# Altium schematic sheet EVO Schematic.SchDoc: Cable Node (part 2 of 3)
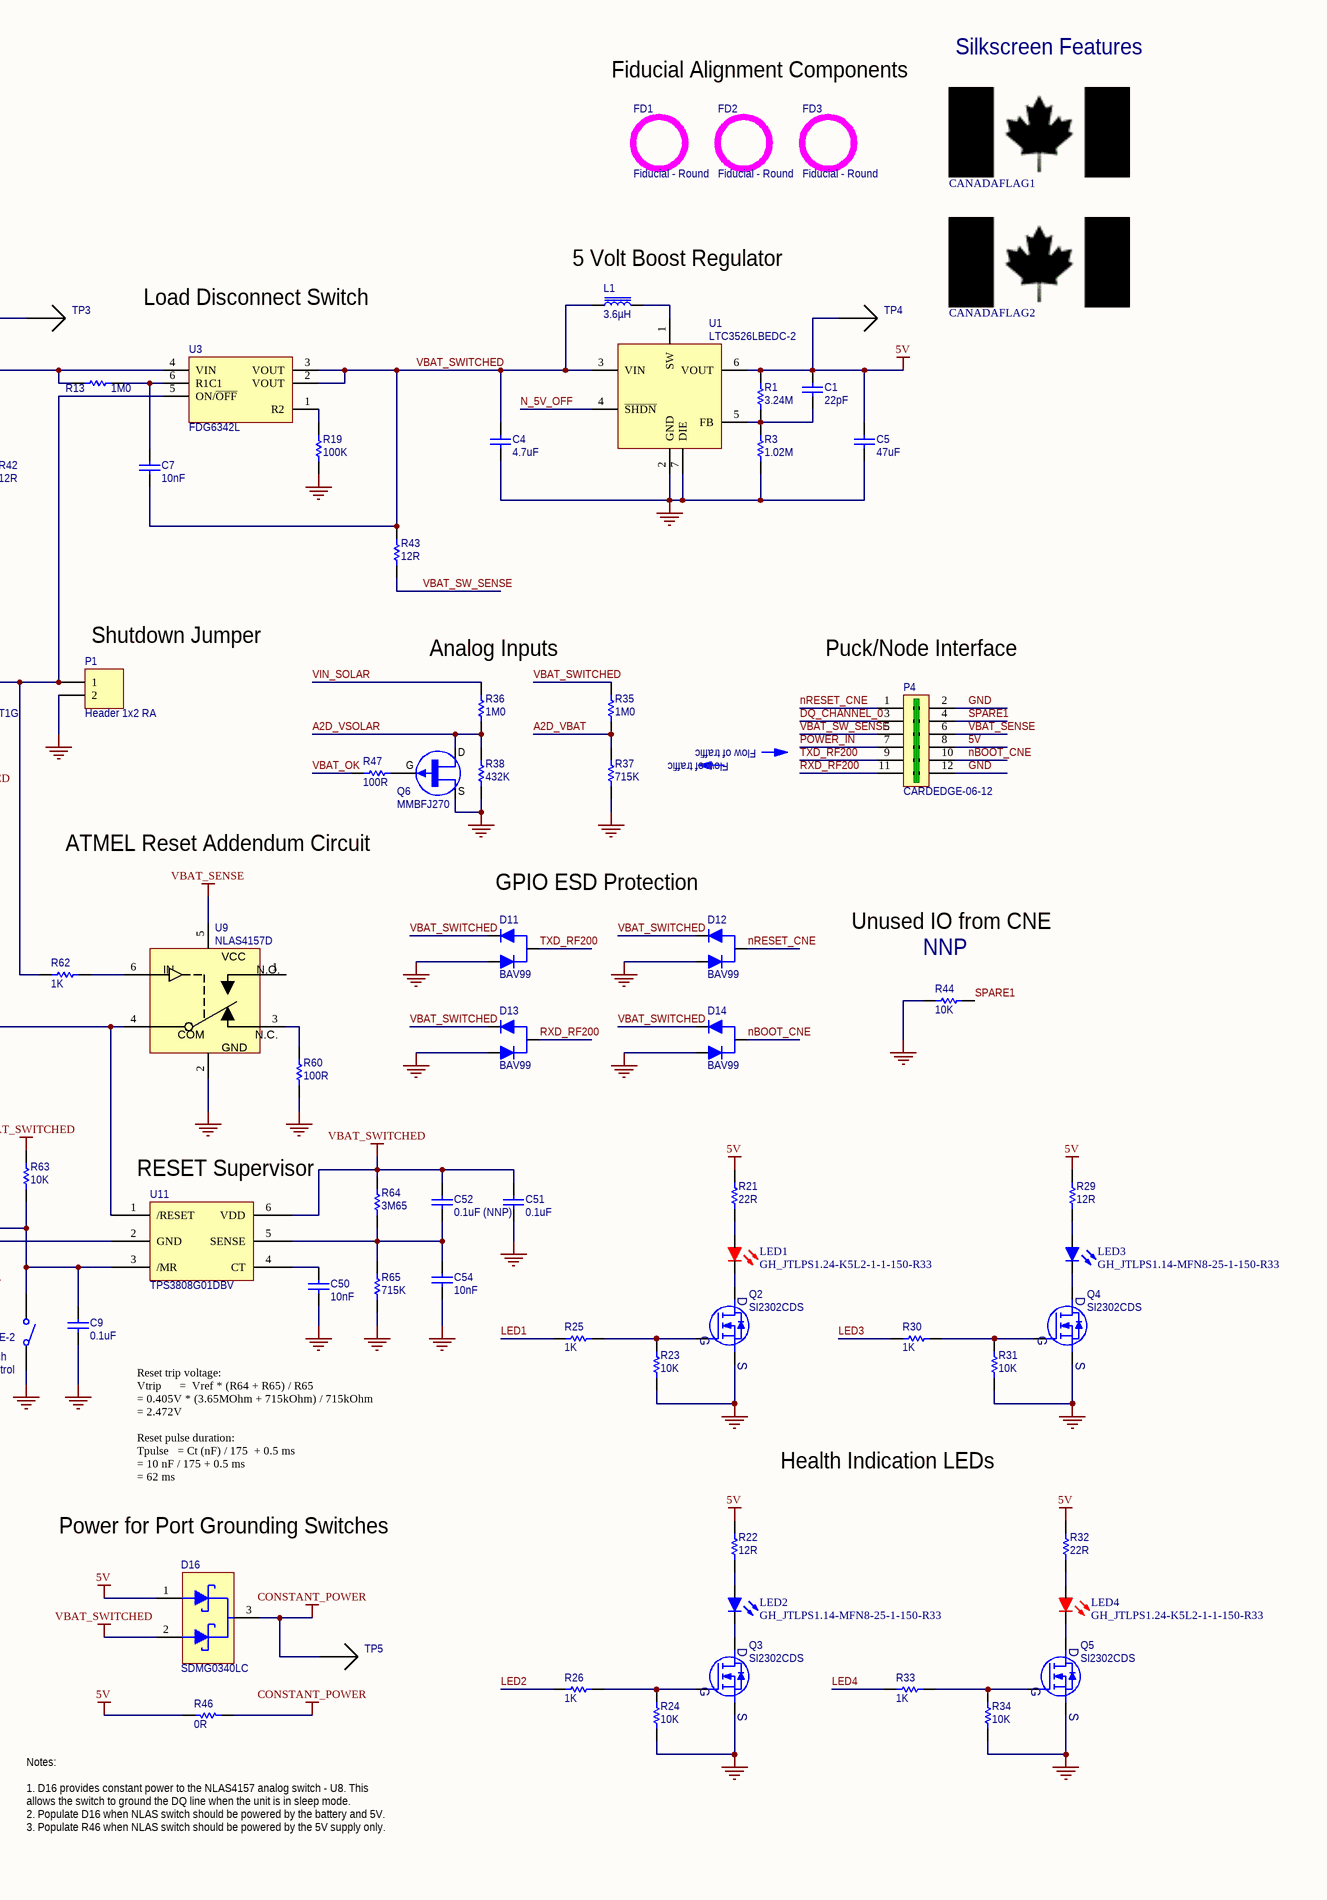
[diagram p2: EVO Schematic.SchDoc, right]
## Library data of the parts
BATT1 = BATT_18650_1: 26650 LiFePO4 3.2V 3300mAh; Manufacturer: TACBattery; Manufacturer Part Number: 26650 3.2V 1500mAh with wire; OPI_VID: 101392
C1 = CC0805JRNPO9BN220: CAP CER 22PF 50V 5% NPO 0805; Manufacturer: Yageo; Temperature Coefficient: C0G, NP0; OPI_VID: 100045; Supplier 1: Digi-Key; Manufacturer Part Number: CC0805JRNPO9BN220; RoHS: RoHS Compliant; Category: Capacitors; Stock 1: 184000; Pricing 1: 4000=0.0128, 8000=0.01169, 12000=0.01113, 28000=0.01057, 100000=0.00765 (CAD); Capacitance: 22pF; Voltage - Rated: 50V; Tolerance: ±5%; Mounting Type: Surface Mount, MLCC; Operating Temperature: -55°C ~ 125°C; Applications: General Purpose; Ratings: -; Package / Case: 0805 (2012 Metric); Size / Dimension: 0.079" L x 0.049" W (2.00mm x 1.25mm); Height - Seated (Max): -; Thickness (Max): 0.024" (0.60mm); Lead Spacing: -; Features: -; Packaging: Tape & Reel (TR); Lead Style: -; ComponentLink1URL: http://www.yageo.com/documents/recent/UPY-GP_NP0_16V-to-50V_8.pdf; ComponentLink1Description: http://www.yageo.com/documents/recent/UPY-GP_NP0_16V-to-50V_8.pdf; Supplier Part Number 1: 311-1103-2-ND
C2-C4 = JMK212BJ475KG-T: CAP CER 4.7UF 6.3V 10% X5R 0805; Manufacturer: Taiyo Yuden; Capacitance: 4.7µF; OPI_VID: 101023; Supplier 1: Digi-Key; Manufacturer Part Number: JMK212BJ475KG-T; RoHS: RoHS Compliant; Category: Capacitors; Stock 1: 114000; Pricing 1: 3000=0.02419, 6000=0.02213, 9000=0.02059, 15000=0.01956, 30000=0.01853 (CAD); Voltage - Rated: 6.3V; Tolerance: ±10%; Temperature Coefficient: X5R; Mounting Type: Surface Mount, MLCC; Operating Temperature: -55°C ~ 85°C; Applications: General Purpose; Ratings: -; Package / Case: 0805 (2012 Metric); Size / Dimension: 0.079" L x 0.049" W (2.00mm x 1.25mm); Height - Seated (Max): -; Thickness (Max): 0.053" (1.35mm); Lead Spacing: -; Features: -; Packaging: Tape & Reel (TR); Lead Style: -; ComponentLink1URL: http://www.yuden.co.jp/productdata/catalog/en/mlcc01_e.pdf; ComponentLink1Description: http://www.yuden.co.jp/productdata/catalog/en/mlcc01_e.pdf; Supplier Part Number 1: 587-1302-2-ND
C5 C8 = LMK316BJ476ML-T: CAP CER 47UF 10V 20% X5R 1206; Manufacturer: Taiyo Yuden; Capacitance: 47µF; OPI_VID: 101319; Supplier 1: Digi-Key; Supplier Part Number 1: 587-1780-2-ND; Manufacturer Part Number: LMK316BJ476ML-T; RoHS: RoHS Compliant; Category: Capacitors; Stock 1: 38000; Pricing 1: 2000=0.20677, 4000=0.19298, 10000=0.18609, 14000=0.18333, 50000=0.17575 (CAD); Voltage - Rated: 10V; Tolerance: ±20%; Temperature Coefficient: X5R; Mounting Type: Surface Mount, MLCC; Operating Temperature: -55°C ~ 85°C; Applications: General Purpose; Ratings: -; Package / Case: 1206 (3216 Metric); Size / Dimension: 0.126" L x 0.063" W (3.20mm x 1.60mm); Height - Seated (Max): -; Thickness (Max): 0.071" (1.80mm); Lead Spacing: -; Features: -; Packaging: Tape & Reel (TR); Lead Style: -; ComponentLink1URL: http://www.yuden.co.jp/productdata/catalog/en/mlcc01_e.pdf; ComponentLink1Description: http://www.yuden.co.jp/productdata/catalog/en/mlcc01_e.pdf
C6 = C2012X7R2A103K: CAP CER 10000PF 100V X7R 0805; Manufacturer: TDK Corporation; Tolerance: ±10%; OPI_VID: 101320; Supplier 1: Digi-Key; Manufacturer Part Number: C2012X7R2A103K; RoHS: RoHS Compliant; Category: Capacitors; Stock 1: 44000; Pricing 1: 4000=0.01844, 8000=0.01716, 12000=0.0163, 28000=0.01544, 100000=0.01169 (CAD); Capacitance: 10000pF; Voltage - Rated: 100V; Temperature Coefficient: X7R; Mounting Type: Surface Mount, MLCC; Operating Temperature: -55°C ~ 125°C; Applications: General Purpose; Ratings: -; Package / Case: 0805 (2012 Metric); Size / Dimension: 0.079" L x 0.049" W (2.00mm x 1.25mm); Height - Seated (Max): -; Thickness (Max): 0.037" (0.95mm); Lead Spacing: -; Features: -; Packaging: Tape & Reel (TR); Lead Style: -; ComponentLink1URL: http://www.tdk.com/pdf/mid_volt_B11.pdf; ComponentLink1Description: http://www.tdk.com/pdf/mid_volt_B11.pdf; Supplier Part Number 1: 445-1343-2-ND
C7 C50 C54 = C1608X7R1H103K: CAP CER 10000PF 50V 10% X7R 0603; Manufacturer: TDK Corporation; OPI_VID: 101017; Supplier 1: Digi-Key; Supplier Part Number 1: 445-1311-2-ND; Manufacturer Part Number: C1608X7R1H103K; RoHS: RoHS Compliant; Category: Capacitors; Stock 1: 292000; Pricing 1: 4000=0.00488, 8000=0.00445, 12000=0.00424, 28000=0.00403, 100000=0.00292 (CAD); Capacitance: 10000pF; Voltage - Rated: 50V; Tolerance: ±10%; Temperature Coefficient: X7R; Mounting Type: Surface Mount, MLCC; Operating Temperature: -55°C ~ 125°C; Applications: General Purpose; Ratings: -; Package / Case: 0603 (1608 Metric); Size / Dimension: 0.063" L x 0.031" W (1.60mm x 0.80mm); Height - Seated (Max): -; Thickness (Max): 0.037" (0.95mm); Lead Spacing: -; Features: -; Packaging: Tape & Reel (TR); Lead Style: -; ComponentLink1URL: http://www.tdk.com/pdf/general_B11.pdf; ComponentLink1Description: http://www.tdk.com/pdf/general_B11.pdf
C9 = 0603YC104KAT2A: CAP CERM .1UF 10% 16V X7R 0603; Manufacturer: AVX Corporation; Capacitance: 0.1µF; OPI_VID: 100039; Category 1: Capacitors; Supplier 1: Digi-Key; Manufacturer Part Number: 0603YC104KAT2A; Stock 1: 5240000; Pricing 1: 4000=0.003, 12000=0.002, 24000=0.002 (USD); Voltage - Rated: 16V; Tolerance: ±10%; Temperature Coefficient: X7R; Mounting Type: Surface Mount, MLCC; Operating Temperature: -55°C ~ 125°C; Applications: General Purpose; Ratings: -; Package / Case: 0603 (1608 Metric); Size / Dimension: 0.063" L x 0.031" W (1.60mm x 0.80mm); Lead Spacing: -; Features: -; Packaging: Tape & Reel (TR); Lead Style: -; ComponentLink1URL: http://www.avx.com/docs/Catalogs/cx7r.pdf; ComponentLink1Description: http://www.avx.com/docs/Catalogs/cx7r.pdf; Supplier Part Number 1: 478-1239-2-ND; RoHS 1: RoHS Compliant; Description 1: CAP CERM .1UF 10% 16V X7R 0603; Thickness: 0.90mm Max
C10 C11 C20 C51-C53 = 0603YC104KAT2A: CAP CERM .1UF 10% 16V X7R 0603; Manufacturer: AVX Corporation; Category 1: Capacitors; Capacitance: 0.1µF; OPI_VID: 100039; Supplier 1: Digi-Key; Supplier Part Number 1: 478-1239-2-ND; RoHS 1: RoHS Compliant; Description 1: CAP CERM .1UF 10% 16V X7R 0603; Stock 1: 5240000; Pricing 1: 4000=0.003, 12000=0.002, 24000=0.002 (USD); Voltage - Rated: 16V; Tolerance: ±10%; Temperature Coefficient: X7R; Mounting Type: Surface Mount, MLCC; Operating Temperature: -55°C ~ 125°C; Features: -; Applications: General Purpose; Ratings: -; Package / Case: 0603 (1608 Metric); Size / Dimension: 0.063" L x 0.031" W (1.60mm x 0.80mm); Thickness: 0.90mm Max; Lead Spacing: -; Packaging: Tape & Reel (TR); Lead Style: -; ComponentLink1URL: http://www.avx.com/docs/Catalogs/cx7r.pdf; ComponentLink1Description: http://www.avx.com/docs/Catalogs/cx7r.pdf; Manufacturer Part Number: 0603YC104KAT2A
CANADAFLAG1 CANADAFLAG2 = CanadaFlag
D1 D4 = DFLS1200-7: DIODE SCHOTTKY 1A 200V PWRDI 123; Manufacturer: Diodes Inc; Voltage - Forward (Vf) (Max) @ If: 850mV @ 1A; Speed: Fast Recovery =< 500ns, > 200mA (Io); Current - Reverse Leakage @ Vr: 2µA @ 200V; Capacitance @ Vr, F: 23pF @ 5V, 1MHz; OPI_VID: 101018; Supplier 1: Digi-Key; Supplier Part Number 1: DFLS1200DITR-ND; Manufacturer Part Number: DFLS1200-7; RoHS: RoHS Compliant; Category: Discrete Semiconductor Products; Stock 1: 21000; Pricing 1: 3000=0.22411, 6000=0.21017, 12000=0.19516, 27000=0.18444, 51000=0.18122 (CAD); Diode Type: Schottky; Voltage - DC Reverse (Vr) (Max): 200V; Current - Average Rectified (Io): 1A; Reverse Recovery Time (trr): -; Mounting Type: Surface Mount; Package / Case: 2-SMD, Flat Lead; Supplier Device Package: PowerDI™ 123; Packaging: Tape & Reel (TR); ComponentLink1URL: http://www.diodes.com/datasheets/ds30628.pdf; ComponentLink1Description: http://www.diodes.com/datasheets/ds30628.pdf
D2 D5 D10 = PGB1010603NR: SUPPRESSOR ESD 24VDC 0603 SMD; Manufacturer: Littelfuse Inc; Category 1: Circuit Protection; Voltage - Reverse Standoff (Typ): 24V; Polarization: Bidirectional; OPI_VID: 101020; Supplier 1: Digi-Key; Supplier Part Number 1: F3591TR-ND; RoHS 1: RoHS Compliant; Description 1: SUPPRESSOR ESD 24VDC 0603 SMD; Stock 1: 10000; Pricing 1: 5000=0.189, 10000=0.176, 25000=0.166 (USD); Voltage - Breakdown: -; Power (Watts): -; Mounting Type: Surface Mount; Package / Case: 0603 (1608 Metric); Supplier Device Package: 0603 (1608 Metric); Packaging: Tape & Reel (TR); ComponentLink1URL: http://www.littelfuse.com/data/en/Data_Sheets/Littelfuse_PulseGuard-ESD_PGB1.pdf; ComponentLink1Description: http://www.littelfuse.com/data/en/Data_Sheets/Littelfuse_PulseGuard-ESD_PGB1.pdf; Manufacturer Part Number: PGB1010603NR
D3 D11-D14 = BAV99-7-F: DIODE SW DUAL 75V 350MW SOT23-3; Manufacturer: Diodes Inc; Voltage - Forward (Vf) (Max) @ If: 1.25V @ 150mA; Current - Reverse Leakage @ Vr: 2.5µA @ 75V; Current - Average Rectified (Io) (per Diode): 300mA (DC); Reverse Recovery Time (trr): 4ns; Diode Type: Standard; Speed: Fast Recovery =< 500ns, > 200mA (Io); Diode Configuration: 1 Pair Series Connection; OPI_VID: 101321; Supplier 1: Digi-Key; Manufacturer Part Number: BAV99-7-F; RoHS: RoHS Compliant; Category: Discrete Semiconductor Products; Stock 1: 297000; Pricing 1: 3000=0.02704, 6000=0.02439, 15000=0.02121, 30000=0.01909, 75000=0.01697, 150000=0.0141 (CAD); Voltage - DC Reverse (Vr) (Max): 75V; Mounting Type: Surface Mount; Package / Case: TO-236-3, SC-59, SOT-23-3; Supplier Device Package: SOT-23-3; Packaging: Tape & Reel (TR); ComponentLink1URL: http://www.diodes.com/datasheets/ds12007.pdf; ComponentLink1Description: http://www.diodes.com/datasheets/ds12007.pdf; Supplier Part Number 1: BAV99-FDITR-ND
D6 D8 D9 = ESD5B5.0ST1G: TVS BIDIRECT 50W SOD523; Manufacturer: ON Semiconductor; Voltage - Reverse Standoff (Typ): 5V; Voltage - Breakdown: 5.8V; Polarization: Bidirectional; OPI_VID: 101019; Supplier 1: Digi-Key; Supplier Part Number 1: ESD5B5.0ST1GOSTR-ND; Manufacturer Part Number: ESD5B5.0ST1G; RoHS: RoHS Compliant; Category: Circuit Protection; Stock 1: 240000; Pricing 1: 3000=0.06935, 6000=0.06253, 12000=0.05571, 24000=0.0523, 48000=0.04661, 96000=0.04548 (CAD); Power (Watts): 50W; Mounting Type: Surface Mount; Package / Case: SC-79, SOD-523; Supplier Device Package: SOD-523; Packaging: Tape & Reel (TR); ComponentLink1URL: http://www.onsemi.com/pub_link/Collateral/ESD5B5.0ST1G.PDF; ComponentLink1Description: http://www.onsemi.com/pub_link/Collateral/ESD5B5.0ST1G.PDF
D15 = DDZ5V6ASF-7: DIODE ZENER 5.42V 500MW SOD323F; Manufacturer: Diodes Inc; Voltage - Forward (Vf) (Max) @ If: 900mV @ 10mA; Current - Reverse Leakage @ Vr: 7.5µA @ 2V; Tolerance: ±2%; Impedance (Max) (Zzt): 80 Ohm; OPI_VID: 101383; Supplier 1: Digi-Key; Supplier Part Number 1: DDZ5V6ASF-7DITR-ND; Manufacturer Part Number: DDZ5V6ASF-7; RoHS: RoHS Compliant; Category: Discrete Semiconductor Products; Stock 1: 6000; Pricing 1: 3000=0.02937, 6000=0.02649, 15000=0.02304, 30000=0.02073, 75000=0.01843, 150000=0.01532 (CAD); Voltage - Zener (Nom) (Vz): 5.42V; Power - Max: 500mW; Mounting Type: Surface Mount; Package / Case: SC-90, SOD-323F; Supplier Device Package: SOD-323F; Packaging: Tape & Reel (TR); Operating Temperature: -65°C ~ 150°C; ComponentLink1URL: http://www.diodes.com/datasheets/ds31987.pdf; ComponentLink1Description: http://www.diodes.com/datasheets/ds31987.pdf
D16 = SDMG0340LC-7-F: DIODE SCHOTTKY 40V 30MA SOT323; Manufacturer: Diodes Inc; Voltage - Forward (Vf) (Max) @ If: 370mV @ 1mA; Current - Reverse Leakage @ Vr: 1µA @ 10V; Current - Average Rectified (Io) (per Diode): 30mA (DC); Speed: Small Signal =< 200mA (Io), Any Speed; Diode Configuration: 1 Pair Common Cathode; OPI_VID: 101482; Supplier 1: Digi-Key; Supplier Part Number 1: SDMG0340LC-FDITR-ND; Manufacturer Part Number: SDMG0340LC-7-F; RoHS: RoHS Compliant; Category: Discrete Semiconductor Products; Stock 1: 18000; Pricing 1: 3000=0.08059, 6000=0.07254, 15000=0.06447, 30000=0.06045, 75000=0.05359, 150000=0.05037 (CAD); Packaging: Tape & Reel (TR); Voltage - DC Reverse (Vr) (Max): 40V; Reverse Recovery Time (trr): -; Diode Type: Schottky; Mounting Type: Surface Mount; Package / Case: SC-70, SOT-323; Supplier Device Package: SOT-323; ComponentLink1URL: http://www.diodes.com/datasheets/ds30248.pdf; ComponentLink1Description: http://www.diodes.com/datasheets/ds30248.pdf
F1 = MINISMDC260F-2: POLYSWITCH 2.6A RESET FUSE SMD; Manufacturer: TE Connectivity; Current - Trip (It): 5A; Current - Max: 100A; Voltage - Max: 6V; R Min/Max: 0.015 ~ 0.043 Ohm; Time to Trip: 7s; OPI_VID: 101385; Supplier 1: Digi-Key; Manufacturer Part Number: MINISMDC260F-2; RoHS: RoHS Compliant; Category: Circuit Protection; Stock 1: 6000; Pricing 1: 2000=0.2349, 6000=0.21802, 10000=0.18285, 26000=0.17582, 50000=0.16879 (CAD); Current - Hold (Ih) (Max): 2.6A; Package / Case: 1812 (4532 Metric), Concave; Packaging: Tape & Reel (TR); ComponentLink1URL: http://www.te.com/commerce/DocumentDelivery/DDEController?Action=showdoc&DocId=Catalog+Section%7FSURFACE-MOUNT%7FA1%7Fpdf%7FEnglish%7FENG_CS_SURFACE-MOUNT_A1.pdf; ComponentLink1Description: http://www.te.com/commerce/DocumentDelivery/DDEController?Action=showdoc&DocId=Catalog+Section%7FSURFACE-MOUNT%7FA1%7Fpdf%7FEnglish%7FENG_CS_SURFACE-MOUNT_A1.pdf; Supplier Part Number 1: MINISMDC260FTR-ND
F2 F3 = MINISMDC050F-2: POLYSWITCH .50A RESET FUSE SMD; Manufacturer: TE Connectivity; Voltage - Max: 24V; Current - Max: 100A; Current - Hold (Ih) (Max): 500mA; Current - Trip (It): 1A; R Min/Max: 0.150 ~ 1.000 Ohm; Time to Trip: 0.15s; OPI_VID: 101164; Supplier 1: Digi-Key; Supplier Part Number 1: MINISMDC050FTR-ND; Manufacturer Part Number: MINISMDC050F-2; RoHS: RoHS Compliant; Category: Circuit Protection; Stock 1: 166000; Pricing 1: 2000=0.19128, 6000=0.17753, 10000=0.1489, 26000=0.14317, 50000=0.13745 (CAD); Package / Case: 1812 (4532 Metric), Concave; Packaging: Tape & Reel (TR); ComponentLink1URL: http://documents.tycoelectronics.com/commerce/DocumentDelivery/DDEController?Action=showdoc&DocId=Specification+Or+Standard%7FSCD25063%7FH%7Fpdf%7FEnglish%7FENG_SS_SCD25063_H.pdf; ComponentLink1Description: http://documents.tycoelectronics.com/commerce/DocumentDelivery/DDEController?Action=showdoc&DocId=Specification+Or+Standard%7FSCD25063%7FH%7Fpdf%7FEnglish%7FENG_SS_SCD25063_H.pdf
FD1-FD3 = Fiducial: Fiducial Round
J1 = 436500216: CONN HEADER 2POS 3MM VERT GOLD; Manufacturer: Molex Inc; Connector Type: Header, Shrouded; Number of Positions: 2; Number of Positions Loaded: All; Pitch: 0.118" (3.00mm); OPI_VID: 101531; Supplier 1: Digi-Key; Manufacturer Part Number: 436500216; RoHS: RoHS Compliant; Category: Connectors, Interconnects; Stock 1: 29740; Pricing 1: 1=0.82, 10=0.766, 50=0.612, 100=0.5866, 250=0.53552, 500=0.51002, 1000=0.42077, 2500=0.38251, 5000=0.36976 (CAD); Contact Type: Male Pin; Number of Rows: 1; Row Spacing: -; Contact Mating Length: -; Mounting Type: Through Hole; Termination: Press-Fit; Fastening Type: Locking Ramp; Features: Board Guide; Contact Finish: Tin; Contact Finish Thickness: 100µin (2.54µm); Color: Black; Packaging: Tray; ComponentLink1URL: http://www.molex.com/pdm_docs/sd/436500215_sd.pdf; ComponentLink1Description: http://www.molex.com/pdm_docs/sd/436500215_sd.pdf
L1 = 744031003: INDUCTOR POWER 3.6UH 1.38A SMD; Manufacturer: Wurth Electronics Inc; Current - Saturation: 1.1A; Type: Ferrite Core; Tolerance: ±30%; Shielding: Shielded; DC Resistance (DCR): 85 mOhm Max; Frequency - Self Resonant: 80MHz; Material - Core: Ferrite; Frequency - Test: 100kHz; OPI_VID: 101322; Supplier 1: Digi-Key; Manufacturer Part Number: 744031003; RoHS: RoHS Compliant; Category: Inductors, Coils, Chokes; Stock 1: 0; Pricing 1: 1000=0.76734 (CAD); Inductance: 3.6µH; Current: 1.38A; Current - Temperature Rise: -; Q @ Freq: -; Package / Case: 1515 (3838 Metric); Mounting Type: Surface Mount; Packaging: Tape & Reel (TR); Operating Temperature: -40°C ~ 125°C; ComponentLink1URL: http://katalog.we-online.de/kataloge/eisos/media/pdf/744031003.pdf; ComponentLink1Description: http://katalog.we-online.de/kataloge/eisos/media/pdf/744031003.pdf; Supplier Part Number 1: 732-1007-2-ND
L2 = SRR0604-220ML: INDUCTOR PWR 22UH 20% SHIELD SMD; Manufacturer: Bourns Inc.; Current: 900mA; Current - Saturation: 1.2A; Type: Ferrite Core; Shielding: Shielded; DC Resistance (DCR): 190 mOhm; Q @ Freq: 16 @ 2.52MHz; Frequency - Self Resonant: 25MHz; Material - Core: Ferrite; Frequency - Test: 1kHz; OPI_VID: 101323; Supplier 1: Digi-Key; Manufacturer Part Number: SRR0604-220ML; RoHS: RoHS Compliant; Category: Inductors, Coils, Chokes; Stock 1: 0; Pricing 1: 1000=0.37682, 5000=0.36426, 10000=0.3517, 25000=0.33914 (CAD); Inductance: 22µH; Current - Temperature Rise: -; Tolerance: ±20%; Package / Case: 0.256" L x 0.256" W x 0.189" H (6.50mm x 6.50mm x 4.80mm); Mounting Type: Surface Mount; Packaging: Tape & Reel (TR); Operating Temperature: -40°C ~ 125°C; ComponentLink1URL: http://www.bourns.com/data/global/pdfs/SRR0604.pdf; ComponentLink1Description: http://www.bourns.com/data/global/pdfs/SRR0604.pdf; Supplier Part Number 1: SRR0604-220MLTR-ND
LED1 LED4 = GH_JTLPS1.24-K5L2-1-1-150-R33: LED; Manufacturer_Name: OSRAM; Manufacturer_Part_Number: GH JTLPS1.24-K5L2-1-1-150-R33; Height: 0.8mm
LED2 LED3 = GH_JTLPS1.14-MFN8-25-1-150-R33: LED; Manufacturer_Name: OSRAM; Manufacturer_Part_Number: GH JTLPS1.24-K5L2-1-1-150-R33; Height: 0.8mm
MH1-MH3 = MountingHole: PCB Mounting Hole, 0.150" hole, 0.270" Keepout
P1 = M20-9960245: SIL HORIZ PC TAIL PIN HEADER; Manufacturer: Harwin Inc; Connector Type: Header, Unshrouded, Breakaway; Number of Positions: 2; Number of Positions Loaded: All; Pitch: 0.100" (2.54mm); OPI_VID: 101483; Supplier 1: Digi-Key; Supplier Part Number 1: 952-2244-ND; Manufacturer Part Number: M20-9960245; RoHS: RoHS Compliant; Category: Connectors, Interconnects; Stock 1: 1174; Pricing 1: 1=0.31, 10=0.18, 25=0.1288, 50=0.0978, 100=0.0798, 250=0.06692, 500=0.06178, 1000=0.05406, 2500=0.04119 (CAD); Packaging: Bulk; Contact Type: Male Pin; Number of Rows: 1; Row Spacing: -; Contact Mating Length: 0.240" (6.10mm); Mounting Type: Through Hole, Right Angle; Termination: Solder; Fastening Type: -; Features: -; Contact Finish: Gold; Contact Finish Thickness: -; Color: Black; ComponentLink1URL: http://www.harwin.com/include/downloads/drawings/M20-996.PDF; ComponentLink1Description: http://www.harwin.com/include/downloads/drawings/M20-996.PDF
P2 = Header 4: Header, 4-Pin; Manufacturer: 3M; Manufacturer Part Number: 2340-6111TG; OPI_VID: 100210; LatestRevisionDate: 17-Jul-2002; LatestRevisionNote: Re-released for DXP Platform.; Publisher: Altium Limited
P3 = Header 2: Header, 2-Pin; Manufacturer: 3M; Manufacturer Part Number: 2340-6111TG; OPI_VID: 100210; LatestRevisionDate: 17-Jul-2002; LatestRevisionNote: Re-released for DXP Platform.; Publisher: Altium Limited
P4 = CARDEDGE-06-12: CONN EDGECARD 6POS .100 FINGERS; Gender: Male; Number of Positions: 12; Pitch: 0.100" (2.54mm); Number of Rows: 2; Contact Finish: Gold; Contact Finish Thickness: 30µin (0.76µm)
P5 = 1759020: CONN HEADER RT ANG 3POS 5.08MM; Manufacturer: Phoenix Contact; Positions Per Level: 3; Pitch: 0.200" (5.08mm); Number of Levels: 1; Header Orientation: 90°, Right Angle; Current: 10A; Voltage: 300V; OPI_VID: 101377; Supplier 1: Digi-Key; Manufacturer Part Number: 1759020; RoHS: RoHS Compliant; Category: Connectors, Interconnects; Stock 1: 4474; Pricing 1: 1=0.85, 10=0.826, 50=0.7716, 100=0.7098, 250=0.65576, 500=0.62494, 1000=0.58636 (CAD); Terminal Block Type: Header, Male Pins, Shrouded (2 Side); Plug Wire Entry: -; Termination: Solder; Wire Gauge: -; Mounting Type: Through Hole; Features: -; Color: Green; Packaging: Bulk; ComponentLink1URL: http://media.digikey.com/pdf/Data%20Sheets/Phoenix%20Contact%20PDFs/1759020.pdf; ComponentLink1Description: http://media.digikey.com/pdf/Data%20Sheets/Phoenix%20Contact%20PDFs/1759020.pdf; Supplier Part Number 1: 277-1096-ND
P6 P7 = 3M-950512-6102-AR: CONN SOCKET 12POS 2MM VERT T/H; Manufacturer: 3M; Connector Type: Receptacle; Number of Positions: 12; Number of Positions Loaded: All; Pitch: 0.079" (2.00mm); OPI_VID: 101515; Category 1: Connectors, Interconnects; Supplier 1: Digi-Key; Supplier Part Number 1: 3M9406-ND; Stock 1: 2590; Pricing 1: 1=2.31, 25=1.9756, 50=1.8896, 100=1.8037, 250=1.63196, 500=1.50312, 1000=1.28839, 2500=1.2025, 5000=1.14237 (CAD); Contact Type: Female Socket; Number of Rows: 1; Row Spacing: -; Mounting Type: Through Hole; Termination: Solder; Fastening Type: -; Features: -; Contact Finish: Gold; Contact Finish Thickness: Flash; Color: Black; Packaging: Tube; ComponentLink1URL: http://multimedia.3m.com/mws/mediawebserver?66666UuZjcFSLXTtmXMEm8TaEVuQEcuZgVs6EVs6E666666--; ComponentLink1Description: http://multimedia.3m.com/mws/mediawebserver?66666UuZjcFSLXTtmXMEm8TaEVuQEcuZgVs6EVs6E666666--; RoHS 1: RoHS Compliant; Description 1: CONN SOCKET 12POS 2MM VERT T/H
Q1 = SI2301BDS-T1-E3: MOSFET P-CH 20V 2.2A SOT23-3; Manufacturer: Vishay/Siliconix; FET Type: MOSFET P-Channel, Metal Oxide; FET Feature: Logic Level Gate; Rds On (Max) @ Id, Vgs: 100 mOhm @ 2.8A, 4.5V; Vgs(th) (Max) @ Id: 950mV @ 250µA; Gate Charge (Qg) @ Vgs: 10nC @ 4.5V; Input Capacitance (Ciss) @ Vds: 375pF @ 6V; Power - Max: 700mW; OPI_VID: 100638; Supplier 1: Digi-Key; Supplier Part Number 1: SI2301BDS-T1-E3TR-ND; Manufacturer Part Number: SI2301BDS-T1-E3; RoHS: RoHS Compliant; Category: Discrete Semiconductor Products; Stock 1: 27000; Pricing 1: 3000=0.18924, 6000=0.17754, 12000=0.16479, 27000=0.15628, 51000=0.15309 (CAD); Drain to Source Voltage (Vdss): 20V; Current - Continuous Drain (Id) @ 25° C: 2.2A; Mounting Type: Surface Mount; Package / Case: TO-236-3, SC-59, SOT-23-3; Supplier Device Package: SOT-23-3 (TO-236); Packaging: Tape & Reel (TR); ComponentLink1URL: http://www.vishay.com/doc?72066; ComponentLink1Description: http://www.vishay.com/doc?72066
Q2-Q5 = SI2302CDS-T1-GE3: MOSFET N-CH 20V 2.6A SOT23-3; Manufacturer: Vishay Siliconix; FET Type: MOSFET N-Channel, Metal Oxide; FET Feature: Logic Level Gate; Rds On (Max) @ Id, Vgs: 57 mOhm @ 3.6A, 4.5V; Vgs(th) (Max) @ Id: 850mV @ 250µA; Gate Charge (Qg) @ Vgs: 5.5nC @ 4.5V; Power - Max: 710mW; OPI_VID: 101327; Supplier 1: Digi-Key; Supplier Part Number 1: SI2302CDS-T1-GE3TR-ND; Manufacturer Part Number: SI2302CDS-T1-GE3; RoHS: RoHS Compliant; Category: Discrete Semiconductor Products; Stock 1: 27000; Pricing 1: 3000=0.18079, 6000=0.16912, 15000=0.15746, 30000=0.14871, 75000=0.1458, 150000=0.13996 (CAD); Drain to Source Voltage (Vdss): 20V; Current - Continuous Drain (Id) @ 25° C: 2.6A; Input Capacitance (Ciss) @ Vds: -; Mounting Type: Surface Mount; Package / Case: TO-236-3, SC-59, SOT-23-3; Supplier Device Package: SOT-23-3 (TO-236); Packaging: Tape & Reel (TR); ComponentLink1URL: http://www.vishay.com/docs/68645/si2302cd.pdf; ComponentLink1Description: http://www.vishay.com/docs/68645/si2302cd.pdf
Q6 = MMBFJ270: IC SWITCH P-CHANNEL SOT-23; Manufacturer: Fairchild Semiconductor; Current - Drain (Idss) @ Vds (Vgs: 0)=2mA @ 15V; Voltage - Breakdown (V(BR)GSS): 30V; Voltage - Cutoff (VGS off) @ Id: 500mV @ 1nA; Power - Max: 225mW; OPI_VID: 101484; Supplier 1: Digi-Key; Supplier Part Number 1: MMBFJ270TR-ND; Manufacturer Part Number: MMBFJ270; RoHS: RoHS Compliant; Category: Discrete Semiconductor Products; Stock 1: 15000; Pricing 1: 3000=0.14055, 6000=0.13203, 15000=0.12352, 30000=0.11329, 75000=0.10903, 150000=0.10477 (CAD); Packaging: Tape & Reel (TR); Drain to Source Voltage (Vdss): -; Current Drain (Id) - Max: -; FET Type: P-Channel; Input Capacitance (Ciss) @ Vds: -; Resistance - RDS(On): -; Mounting Type: Surface Mount; Package / Case: TO-236-3, SC-59, SOT-23-3; Supplier Device Package: SOT-23-3 (TO-236); ComponentLink1URL: http://www.fairchildsemi.com/ds/MM/MMBFJ270.pdf; ComponentLink1Description: http://www.fairchildsemi.com/ds/MM/MMBFJ270.pdf
R1 = CRCW08053M24FKEA: RES 3.24M OHM 1/8W 1% 0805 SMD; Manufacturer: Vishay Dale; Power (Watts): 0.125W, 1/8W; Temperature Coefficient: ±100ppm/°C; OPI_VID: 101328; Supplier 1: Digi-Key; Manufacturer Part Number: CRCW08053M24FKEA; RoHS: RoHS Compliant; Category: Resistors; Stock 1: 5000; Pricing 1: 5000=0.00914, 10000=0.00799, 25000=0.00685, 50000=0.00571, 100000=0.00457, 250000=0.00457, 500000=0.00343 (CAD); Resistance (Ohms): 3.24M; Composition: Thick Film; Features: -; Tolerance: ±1%; Package / Case: 0805 (2012 Metric); Size / Dimension: 0.079" L x 0.049" W (2.00mm x 1.25mm); Height: 0.020" (0.50mm); Number of Terminations: 2; Packaging: Tape & Reel (TR); ComponentLink1URL: http://www.vishay.com/doc?20035; ComponentLink1Description: http://www.vishay.com/doc?20035; Supplier Part Number 1: 541-3.24MCTR-ND
R2 R6 R9 = CRCW06033M83FKEA: RES 3.83M OHM 1/10W 1% 0603 SMD; Manufacturer: Vishay Dale; Power (Watts): 0.1W, 1/10W; Temperature Coefficient: ±100ppm/°C; OPI_VID: 101329; Supplier 1: Digi-Key; Manufacturer Part Number: CRCW06033M83FKEA; RoHS: RoHS Compliant; Category: Resistors; Stock 1: 10000; Pricing 1: 5000=0.00644, 10000=0.00579, 25000=0.00515, 50000=0.00429, 100000=0.00356, 250000=0.00322, 500000=0.0029 (CAD); Resistance (Ohms): 3.83M; Composition: Thick Film; Features: Automotive AEC-Q200 Qualified; Tolerance: ±1%; Package / Case: 0603 (1608 Metric); Size / Dimension: 0.061" L x 0.033" W (1.55mm x 0.85mm); Height: 0.020" (0.50mm); Number of Terminations: 2; Packaging: Tape & Reel (TR); ComponentLink1URL: http://www.vishay.com/doc?20035; ComponentLink1Description: http://www.vishay.com/doc?20035; Supplier Part Number 1: 541-3.83MHTR-ND
R3 = CRCW08051M02FKEA: RES 1.02M OHM 1/8W 1% 0805 SMD; Manufacturer: Vishay Dale; Power (Watts): 0.125W, 1/8W; Temperature Coefficient: ±100ppm/°C; OPI_VID: 101330; Supplier 1: Digi-Key; Manufacturer Part Number: CRCW08051M02FKEA; RoHS: RoHS Compliant; Category: Resistors; Stock 1: 20000; Pricing 1: 5000=0.00914, 10000=0.00799, 25000=0.00685, 50000=0.00571, 100000=0.00457, 250000=0.00457, 500000=0.00343 (CAD); Resistance (Ohms): 1.02M; Composition: Thick Film; Features: -; Tolerance: ±1%; Package / Case: 0805 (2012 Metric); Size / Dimension: 0.079" L x 0.049" W (2.00mm x 1.25mm); Height: 0.020" (0.50mm); Number of Terminations: 2; Packaging: Tape & Reel (TR); ComponentLink1URL: http://www.vishay.com/doc?20035; ComponentLink1Description: http://www.vishay.com/doc?20035; Supplier Part Number 1: 541-1.02MCTR-ND
R4 R10 = CRCW06037M50FKEA: RES 7.50M OHM 1/10W 1% 0603 SMD; Manufacturer: Vishay Dale; Power (Watts): 0.1W, 1/10W; Temperature Coefficient: ±100ppm/°C; OPI_VID: 101331; Supplier 1: Digi-Key; Manufacturer Part Number: CRCW06037M50FKEA; RoHS: RoHS Compliant; Category: Resistors; Stock 1: 10000; Pricing 1: 5000=0.00644, 10000=0.00579, 25000=0.00515, 50000=0.00429, 100000=0.00356, 250000=0.00322, 500000=0.0029 (CAD); Resistance (Ohms): 7.5M; Composition: Thick Film; Features: Automotive AEC-Q200 Qualified; Tolerance: ±1%; Package / Case: 0603 (1608 Metric); Size / Dimension: 0.061" L x 0.033" W (1.55mm x 0.85mm); Height: 0.020" (0.50mm); Number of Terminations: 2; Packaging: Tape & Reel (TR); ComponentLink1URL: http://www.vishay.com/doc?20035; ComponentLink1Description: http://www.vishay.com/doc?20035; Supplier Part Number 1: 541-7.50MHTR-ND
R5 = CRCW06032M00FKEA: RES 2.00M OHM 1/10W 1% 0603 SMD; Manufacturer: Vishay Dale; Resistance (Ohms): 2M; Power (Watts): 0.1W, 1/10W; Temperature Coefficient: ±100ppm/°C; OPI_VID: 101448; Supplier 1: Digi-Key; Manufacturer Part Number: CRCW06032M00FKEA; RoHS: RoHS Compliant; Category: Resistors; Stock 1: 12600; Pricing 1: 10=0.096, 50=0.0516, 200=0.02965, 1000=0.02023 (CAD); Composition: Thick Film; Features: Automotive AEC-Q200 Qualified; Tolerance: ±1%; Package / Case: 0603 (1608 Metric); Supplier Device Package: 0603 (1608 Metric); Size / Dimension: 0.061" L x 0.033" W (1.55mm x 0.85mm); Height: 0.020" (0.50mm); Number of Terminations: 2; Packaging: Cut Tape (CT); ComponentLink1URL: http://www.vishay.com/doc?20035; ComponentLink1Description: http://www.vishay.com/doc?20035; Supplier Part Number 1: 541-2.00MHCT-ND
R7 = CRCW06034M22FKEA: RES 4.22M OHM 1/10W 1% 0603 SMD; Manufacturer: Vishay Dale; Power (Watts): 0.1W, 1/10W; Temperature Coefficient: ±100ppm/°C; OPI_VID: 101450; Supplier 1: Digi-Key; Manufacturer Part Number: CRCW06034M22FKEA; RoHS: RoHS Compliant; Category: Resistors; Stock 1: 10000; Pricing 1: 5000=0.00674, 10000=0.00607, 25000=0.00539, 50000=0.00449, 100000=0.00373, 250000=0.00337, 500000=0.00303 (CAD); Resistance (Ohms): 4.22M; Composition: Thick Film; Features: Automotive AEC-Q200 Qualified; Tolerance: ±1%; Package / Case: 0603 (1608 Metric); Supplier Device Package: 0603 (1608 Metric); Size / Dimension: 0.061" L x 0.033" W (1.55mm x 0.85mm); Height: 0.020" (0.50mm); Number of Terminations: 2; Packaging: Tape & Reel (TR); ComponentLink1URL: http://www.vishay.com/doc?20035; ComponentLink1Description: http://www.vishay.com/doc?20035; Supplier Part Number 1: 541-4.22MHTR-ND
R8 = CRCW06034M75FKEA: RES 4.75M OHM 1/10W 1% 0603 SMD; Manufacturer: Vishay Dale; Power (Watts): 0.1W, 1/10W; Temperature Coefficient: ±100ppm/°C; OPI_VID: 101333; Supplier 1: Digi-Key; Manufacturer Part Number: CRCW06034M75FKEA; RoHS: RoHS Compliant; Category: Resistors; Stock 1: 30000; Pricing 1: 5000=0.00644, 10000=0.00579, 25000=0.00515, 50000=0.00429, 100000=0.00356, 250000=0.00322, 500000=0.0029 (CAD); Resistance (Ohms): 4.75M; Composition: Thick Film; Features: Automotive AEC-Q200 Qualified; Tolerance: ±1%; Package / Case: 0603 (1609 Metric); Size / Dimension: 0.061" L x 0.033" W (1.55mm x 0.85mm); Height: 0.020" (0.50mm); Number of Terminations: 2; Packaging: Tape & Reel (TR); ComponentLink1URL: http://www.vishay.com/doc?20035; ComponentLink1Description: http://www.vishay.com/doc?20035; Supplier Part Number 1: 541-4.75MHTR-ND
R11 = CRCW06034M99FKEA: RES 4.99M OHM 1/10W 1% 0603 SMD; Manufacturer: Vishay Dale; Power (Watts): 0.1W, 1/10W; Temperature Coefficient: ±100ppm/°C; OPI_VID: 101381; Supplier 1: Digi-Key; Manufacturer Part Number: CRCW06034M99FKEA; RoHS: RoHS Compliant; Category: Resistors; Stock 1: 20000; Pricing 1: 5000=0.00652, 10000=0.00587, 25000=0.00521, 50000=0.00434, 100000=0.00361, 250000=0.00326, 500000=0.00293 (CAD); Resistance (Ohms): 4.99M; Composition: Thick Film; Features: Automotive AEC-Q200 Qualified; Tolerance: ±1%; Package / Case: 0603 (1608 Metric); Supplier Device Package: 0603 (1608 Metric); Size / Dimension: 0.061" L x 0.033" W (1.55mm x 0.85mm); Height: 0.020" (0.50mm); Number of Terminations: 2; Packaging: Tape & Reel (TR); ComponentLink1URL: http://www.vishay.com/doc?20035; ComponentLink1Description: http://www.vishay.com/doc?20035; Supplier Part Number 1: 541-4.99MHTR-ND
R12 = CRCW06035M36FKEA (2): RES 5.36M OHM 1/10W 1% 0603 SMD; Manufacturer: Vishay Dale; Power (Watts): 0.1W, 1/10W; Temperature Coefficient: ±100ppm/°C; OPI_VID: 101334; Supplier 1: Digi-Key; Manufacturer Part Number: CRCW06035M36FKEA; RoHS: RoHS Compliant; Category: Resistors; Stock 1: 5000; Pricing 1: 5000=0.00644, 10000=0.00579, 25000=0.00515, 50000=0.00429, 100000=0.00356, 250000=0.00322, 500000=0.0029 (CAD); Resistance (Ohms): 5.36M; Composition: Thick Film; Features: Automotive AEC-Q200 Qualified; Tolerance: ±1%; Package / Case: 0603 (1609 Metric); Size / Dimension: 0.061" L x 0.033" W (1.55mm x 0.85mm); Height: 0.020" (0.50mm); Number of Terminations: 2; Packaging: Tape & Reel (TR); ComponentLink1URL: http://www.vishay.com/doc?20035; ComponentLink1Description: http://www.vishay.com/doc?20035; Supplier Part Number 1: 541-5.36MHTR-ND
R13 = ERJ-3GEYJ105V: RES 1.0M OHM 1/10W 5% 0603 SMD; Manufacturer: Panasonic - ECG; Category 1: Resistors; Resistance (Ohms): 1M; Power (Watts): 0.1W, 1/10W; Temperature Coefficient: ±200ppm/°C; OPI_VID: 101039; Supplier 1: Digi-Key; Supplier Part Number 1: P1.0MGDKR-ND; RoHS 1: RoHS Compliant; Description 1: RES 1.0M OHM 1/10W 5% 0603 SMD; Stock 1: 2202551; Pricing 1: 1=0.03, 50=0.0104, 100=0.0079, 250=0.00584, 500=0.00432, 1000=0.00288 (USD); Composition: Thick Film; Features: -; Tolerance: ±5%; Size / Dimension: 0.063" L x 0.031" W (1.60mm x 0.80mm); Height: 0.018" (0.45mm); Number of Terminations: 2; Packaging: Digi-Reel®; Package / Case: 0603 (1608 Metric); ComponentLink1URL: http://industrial.panasonic.com/www-cgi/jvcr13pz.cgi?E+PZ+3+AOA0001+ERJ3GEYJ105V+7+WW; ComponentLink1Description: http://industrial.panasonic.com/www-cgi/jvcr13pz.cgi?E+PZ+3+AOA0001+ERJ3GEYJ105V+7+WW; Manufacturer Part Number: ERJ-3GEYJ105V
R15 = ERJ-3EKF27R0V: RES 27.0 OHM 1/10W 1% 0603 SMD; Manufacturer: Panasonic Electronic Components; Resistance (Ohms): 27; Power (Watts): 0.1W, 1/10W; Temperature Coefficient: ±100ppm/°C; OPI_VID: 101337; Supplier 1: Digi-Key; Manufacturer Part Number: ERJ-3EKF27R0V; RoHS: RoHS Compliant; Category: Resistors; Stock 1: 230000; Pricing 1: 5000=0.0026, 10000=0.00226, 25000=0.00199, 50000=0.00182, 125000=0.00179 (CAD); Composition: Thick Film; Features: -; Tolerance: ±1%; Package / Case: 0603 (1608 Metric); Size / Dimension: 0.063" L x 0.031" W (1.60mm x 0.80mm); Height: 0.022" (0.55mm); Number of Terminations: 2; Packaging: Tape & Reel (TR); ComponentLink1URL: http://industrial.panasonic.com/www-cgi/jvcr13pz.cgi?E+PZ+3+AOA0002+ERJ3EKF27R0V+7+WW; ComponentLink1Description: http://industrial.panasonic.com/www-cgi/jvcr13pz.cgi?E+PZ+3+AOA0002+ERJ3EKF27R0V+7+WW; Supplier Part Number 1: P27.0HTR-ND
R16 R20 R23 R24 R31 R34 R44 R50-R53 R63 R69 = ERJ-3GEYJ103V: RES 10K OHM 1/10W 5% 0603 SMD; Manufacturer: Panasonic Electronic Components; Power (Watts): 0.1W, 1/10W; Temperature Coefficient: ±200ppm/°C; OPI_VID: 101044; Supplier 1: Digi-Key; Manufacturer Part Number: ERJ-3GEYJ103V; RoHS: RoHS Compliant; Category: Resistors; Stock 1: 13440000; Pricing 1: 5000=0.00174, 10000=0.00151, 25000=0.00132, 50000=0.00122, 125000=0.00119 (CAD); Resistance (Ohms): 10k; Composition: Thick Film; Features: -; Tolerance: ±5%; Package / Case: 0603 (1608 Metric); Size / Dimension: 0.063" L x 0.031" W (1.60mm x 0.80mm); Height: 0.022" (0.55mm); Number of Terminations: 2; Packaging: Tape & Reel (TR); ComponentLink1URL: http://industrial.panasonic.com/www-cgi/jvcr13pz.cgi?E+PZ+3+AOA0001+ERJ3GEYJ103V+7+WW; ComponentLink1Description: http://industrial.panasonic.com/www-cgi/jvcr13pz.cgi?E+PZ+3+AOA0001+ERJ3GEYJ103V+7+WW; Supplier Part Number 1: P10KGTR-ND
R17 = ERJ-14NF51R1U: RES 51.1 OHM 1/2W 1% 1210 SMD; Manufacturer: Panasonic Electronic Components; Resistance (Ohms): 51.1; Power (Watts): 0.5W, 1/2W; Temperature Coefficient: ±100ppm/°C; OPI_VID: 101382; Supplier 1: Digi-Key; Manufacturer Part Number: ERJ-14NF51R1U; RoHS: RoHS Compliant; Category: Resistors; Stock 1: 20000; Pricing 1: 5000=0.03979, 10000=0.03714, 25000=0.03528, 50000=0.03456, 125000=0.03382 (CAD); Composition: Thick Film; Features: -; Tolerance: ±1%; Package / Case: 1210 (3225 Metric); Supplier Device Package: 1210; Size / Dimension: 0.126" L x 0.098" W (3.20mm x 2.50mm); Height: 0.028" (0.70mm); Number of Terminations: 2; Packaging: Tape & Reel (TR); ComponentLink1URL: http://industrial.panasonic.com/www-cgi/jvcr13pz.cgi?E+PZ+3+AOA0002+ERJ14NF51R1U+7+WW; ComponentLink1Description: http://industrial.panasonic.com/www-cgi/jvcr13pz.cgi?E+PZ+3+AOA0002+ERJ14NF51R1U+7+WW; Supplier Part Number 1: P51.1AATR-ND
R18 = RMCF2512JT24R0: RES 24 OHM 1W 5% 2512 SMD; Manufacturer: TTI Inc.; Manufacturer Part Number: CRCW251224R0JNEG; Resistance (Ohms): 24; Temperature Coefficient: ±200ppm/°C; OPI_VID: 101380; Supplier 1: Digi-Key; Supplier Part Number 1: RMCF2512JT24R0TR-ND; RoHS: RoHS Compliant; Category: Resistors; Stock 1: 20000; Pricing 1: 4000=0.03773, 8000=0.0343, 12000=0.03201, 28000=0.03041, 100000=0.02916 (CAD); Composition: Thick Film; Features: -; Tolerance: ±5%; Package / Case: 2512 (6432 Metric); Supplier Device Package: 2512; Size / Dimension: 0.248" L x 0.126" W (6.30mm x 3.20mm); Height: 0.028" (0.70mm); Number of Terminations: 2; Packaging: Tape & Reel (TR); ComponentLink1URL: http://www.seielect.com/Catalog/SEI-RMCF_RMCP.pdf; ComponentLink1Description: http://www.seielect.com/Catalog/SEI-RMCF_RMCP.pdf
R19 R67 = ERJ-3GEYJ104V: RES 100K OHM 1/10W 5% 0603 SMD; Manufacturer: Panasonic Electronic Components; Power (Watts): 0.1W, 1/10W; Temperature Coefficient: ±200ppm/°C; OPI_VID: 101335; Supplier 1: Digi-Key; Manufacturer Part Number: ERJ-3GEYJ104V; RoHS: RoHS Compliant; Category: Resistors; Stock 1: 3755000; Pricing 1: 5000=0.00172, 10000=0.00149, 25000=0.00131, 50000=0.0012, 125000=0.00118 (CAD); Resistance (Ohms): 100k; Composition: Thick Film; Features: -; Tolerance: ±5%; Package / Case: 0603 (1608 Metric); Size / Dimension: 0.063" L x 0.031" W (1.60mm x 0.80mm); Height: 0.022" (0.55mm); Number of Terminations: 2; Packaging: Tape & Reel (TR); ComponentLink1URL: http://industrial.panasonic.com/www-cgi/jvcr13pz.cgi?E+PZ+3+AOA0001+ERJ3GEYJ104V+7+WW; ComponentLink1Description: http://industrial.panasonic.com/www-cgi/jvcr13pz.cgi?E+PZ+3+AOA0001+ERJ3GEYJ104V+7+WW; Supplier Part Number 1: P100KGTR-ND
R21 R32 = RC1206FR-0722RL: RES 22.0 OHM 1/4W 1% 1206 SMD; Manufacturer: Yageo; Resistance (Ohms): 22; Power (Watts): 0.25W, 1/4W; Temperature Coefficient: ±100ppm/°C; OPI_VID: 101340; Supplier 1: Digi-Key; Supplier Part Number 1: 311-22.0FRTR-ND; Manufacturer Part Number: RC1206FR-0722RL; RoHS: RoHS Compliant; Category: Resistors; Stock 1: 45000; Pricing 1: 5000=0.00427, 10000=0.00371, 25000=0.00326, 50000=0.00299, 125000=0.00293 (CAD); Composition: Thick Film; Features: -; Tolerance: ±1%; Package / Case: 1206 (3216 Metric); Size / Dimension: 0.122" L x 0.063" W (3.10mm x 1.60mm); Height: 0.026" (0.65mm); Number of Terminations: 2; Packaging: Tape & Reel (TR); ComponentLink1URL: http://www.yageo.com/documents/recent/PYu-RC1206_51_RoHS_L_4.pdf; ComponentLink1Description: http://www.yageo.com/documents/recent/PYu-RC1206_51_RoHS_L_4.pdf
R22 R29 R42 R43 = RC1206FR-0712RL: RES 12.0 OHM 1/4W 1% 1206 SMD; Manufacturer: Yageo; Resistance (Ohms): 12; Power (Watts): 0.25W, 1/4W; Temperature Coefficient: ±100ppm/°C; OPI_VID: 101341; Supplier 1: Digi-Key; Supplier Part Number 1: 311-12.0FRTR-ND; Manufacturer Part Number: RC1206FR-0712RL; RoHS: RoHS Compliant; Category: Resistors; Stock 1: 20000; Pricing 1: 5000=0.00427, 10000=0.00371, 25000=0.00326, 50000=0.00299, 125000=0.00293 (CAD); Composition: Thick Film; Features: -; Tolerance: ±1%; Package / Case: 1206 (3216 Metric); Size / Dimension: 0.122" L x 0.063" W (3.10mm x 1.60mm); Height: 0.026" (0.65mm); Number of Terminations: 2; Packaging: Tape & Reel (TR); ComponentLink1URL: http://www.yageo.com/documents/recent/PYu-RC1206_51_RoHS_L_4.pdf; ComponentLink1Description: http://www.yageo.com/documents/recent/PYu-RC1206_51_RoHS_L_4.pdf
R25 R26 R30 R33 R62 = ERJ-3GEYJ102V: RES 1.0K OHM 1/10W 5% 0603 SMD; Manufacturer: Panasonic Electronic Components; Power (Watts): 0.1W, 1/10W; Temperature Coefficient: ±200ppm/°C; OPI_VID: 101077; Supplier 1: Digi-Key; Supplier Part Number 1: P1.0KGTR-ND; Manufacturer Part Number: ERJ-3GEYJ102V; RoHS: RoHS Compliant; Category: Resistors; Stock 1: 14380000; Pricing 1: 5000=0.00172, 10000=0.00149, 25000=0.00131, 50000=0.0012, 125000=0.00118 (CAD); Resistance (Ohms): 1k; Composition: Thick Film; Features: -; Tolerance: ±5%; Package / Case: 0603 (1608 Metric); Size / Dimension: 0.063" L x 0.031" W (1.60mm x 0.80mm); Height: 0.022" (0.55mm); Number of Terminations: 2; Packaging: Tape & Reel (TR); ComponentLink1URL: http://industrial.panasonic.com/www-cgi/jvcr13pz.cgi?E+PZ+3+AOA0001+ERJ3GEYJ102V+7+WW; ComponentLink1Description: http://industrial.panasonic.com/www-cgi/jvcr13pz.cgi?E+PZ+3+AOA0001+ERJ3GEYJ102V+7+WW
R27 R28 R40 R41 R47 R60 R66 = ERJ-3GEYJ101V: RES 100 OHM 1/10W 5% 0603 SMD; Manufacturer: Panasonic Electronic Components; Resistance (Ohms): 100; Power (Watts): 0.1W, 1/10W; Temperature Coefficient: ±200ppm/°C; OPI_VID: 101402; Category 1: Resistors; Supplier 1: Digi-Key; Stock 1: 1062394; Pricing 1: 1=0.13, 50=0.016, 100=0.0122, 250=0.00908, 500=0.0067, 1000=0.00447, 2500=0.00378 (CAD); Composition: Thick Film; Features: -; Tolerance: ±5%; Package / Case: 0603 (1608 Metric); Size / Dimension: 0.063" L x 0.031" W (1.60mm x 0.80mm); Height: 0.022" (0.55mm); Packaging: Cut Tape (CT); ComponentLink1URL: http://industrial.panasonic.com/www-cgi/jvcr13pz.cgi?E+PZ+3+AOA0001+ERJ3GEYJ101V+7+WW; ComponentLink1Description: http://industrial.panasonic.com/www-cgi/jvcr13pz.cgi?E+PZ+3+AOA0001+ERJ3GEYJ101V+7+WW; Supplier Part Number 1: P100GCT-ND; RoHS 1: RoHS Compliant; Description 1: RES 100 OHM 1/10W 5% 0603 SMD; Supplier Device Package: 0603; Number of Terminations: 2; Manufacturer Part Number: ERJ-3GEYJ101V
R35 R36 = ERJ-3EKF1004V: RES 1.00M OHM 1/10W 1% 0603 SMD; Manufacturer: Panasonic Electronic Components; Resistance (Ohms): 1M; Power (Watts): 0.1W, 1/10W; Temperature Coefficient: ±100ppm/°C; OPI_VID: 101342; Supplier 1: Digi-Key; Manufacturer Part Number: ERJ-3EKF1004V; RoHS: RoHS Compliant; Category: Resistors; Stock 1: 1695000; Pricing 1: 5000=0.00257, 10000=0.00224, 25000=0.00196, 50000=0.0018, 125000=0.00177 (CAD); Composition: Thick Film; Features: -; Tolerance: ±1%; Package / Case: 0603 (1608 Metric); Size / Dimension: 0.063" L x 0.031" W (1.60mm x 0.80mm); Height: 0.022" (0.55mm); Number of Terminations: 2; Packaging: Tape & Reel (TR); ComponentLink1URL: http://industrial.panasonic.com/www-cgi/jvcr13pz.cgi?E+PZ+3+AOA0002+ERJ3EKF1004V+7+WW; ComponentLink1Description: http://industrial.panasonic.com/www-cgi/jvcr13pz.cgi?E+PZ+3+AOA0002+ERJ3EKF1004V+7+WW; Supplier Part Number 1: P1.00MHTR-ND
R37 R65 = ERJ-3EKF7153V: RES 715K OHM 1/10W 1% 0603 SMD; Manufacturer: Panasonic Electronic Components; Power (Watts): 0.1W, 1/10W; Temperature Coefficient: ±100ppm/°C; OPI_VID: 101343; Supplier 1: Digi-Key; Manufacturer Part Number: ERJ-3EKF7153V; RoHS: RoHS Compliant; Category: Resistors; Stock 1: 210000; Pricing 1: 5000=0.00257, 10000=0.00224, 25000=0.00196, 50000=0.0018, 125000=0.00177 (CAD); Composition: Thick Film; Features: -; Tolerance: ±1%; Package / Case: 0603 (1608 Metric); Size / Dimension: 0.063" L x 0.031" W (1.60mm x 0.80mm); Height: 0.022" (0.55mm); Number of Terminations: 2; Packaging: Tape & Reel (TR); ComponentLink1URL: http://industrial.panasonic.com/www-cgi/jvcr13pz.cgi?E+PZ+3+AOA0002+ERJ3EKF7153V+7+WW; ComponentLink1Description: http://industrial.panasonic.com/www-cgi/jvcr13pz.cgi?E+PZ+3+AOA0002+ERJ3EKF7153V+7+WW; Supplier Part Number 1: P715KHTR-ND; Resistance (Ohms): 715k
R38 = ERJ-3EKF4323V: RES 432K OHM 1/10W 1% 0603 SMD; Manufacturer: Panasonic Electronic Components; Power (Watts): 0.1W, 1/10W; Temperature Coefficient: ±100ppm/°C; OPI_VID: 101344; Supplier 1: Digi-Key; Manufacturer Part Number: ERJ-3EKF4323V; RoHS: RoHS Compliant; Category: Resistors; Stock 1: 75000; Pricing 1: 5000=0.00257, 10000=0.00224, 25000=0.00196, 50000=0.0018, 125000=0.00177 (CAD); Resistance (Ohms): 432k; Composition: Thick Film; Features: -; Tolerance: ±1%; Package / Case: 0603 (1608 Metric); Size / Dimension: 0.063" L x 0.031" W (1.60mm x 0.80mm); Height: 0.022" (0.55mm); Number of Terminations: 2; Packaging: Tape & Reel (TR); ComponentLink1URL: http://industrial.panasonic.com/www-cgi/jvcr13pz.cgi?E+PZ+3+AOA0002+ERJ3EKF4323V+7+WW; ComponentLink1Description: http://industrial.panasonic.com/www-cgi/jvcr13pz.cgi?E+PZ+3+AOA0002+ERJ3EKF4323V+7+WW; Supplier Part Number 1: P432KHTR-ND
R39 = ERJ-6GEYJ331V: RES 330 OHM 1/8W 5% 0805 SMD; Manufacturer: KOA Speer Electronics; Manufacturer Part Number: RK73B2ATTD331J; Resistance (Ohms): 330; Power (Watts): 0.125W, 1/8W; Temperature Coefficient: ±200ppm/°C; OPI_VID: 101386; Supplier 1: Digi-Key; RoHS: RoHS Compliant; Category: Resistors; Stock 1: 895000; Pricing 1: 5000=0.00304, 10000=0.00264, 25000=0.00232, 50000=0.00213, 125000=0.00208 (CAD); Composition: Thick Film; Features: -; Tolerance: ±5%; Package / Case: 0805 (2012 Metric); Size / Dimension: 0.079" L x 0.049" W (2.00mm x 1.25mm); Height: 0.028" (0.70mm); Number of Terminations: 2; Packaging: Tape & Reel (TR); ComponentLink1URL: http://industrial.panasonic.com/www-cgi/jvcr13pz.cgi?E+PZ+3+AOA0001+ERJ6GEYJ331V+7+WW; ComponentLink1Description: http://industrial.panasonic.com/www-cgi/jvcr13pz.cgi?E+PZ+3+AOA0001+ERJ6GEYJ331V+7+WW; Supplier Part Number 1: P330ATR-ND
R45 = RPC2512JT12R0: RES 12 OHM 1W 5% 2512; Manufacturer: Stackpole Electronics Inc; Resistance (Ohms): 12; Temperature Coefficient: ±200ppm/°C; OPI_VID: 101463; Supplier 1: Digi-Key; Supplier Part Number 1: RPC2512JT12R0TR-ND; Manufacturer Part Number: RPC2512JT12R0; RoHS: RoHS Compliant; Category: Resistors; Stock 1: 4000; Pricing 1: 4000=0.10578, 8000=0.10421, 12000=0.0999, 28000=0.09794, 100000=0.09598 (CAD); Packaging: Tape & Reel (TR); Composition: Thick Film; Features: Pulse Withstanding; Tolerance: ±5%; Package / Case: 2512 (6432 Metric); Supplier Device Package: 2512; Size / Dimension: 0.250" L x 0.126" W (6.35mm x 3.20mm); Height: 0.028" (0.70mm); Number of Terminations: 2; ComponentLink1URL: http://www.seielect.com/Catalog/SEI-RPC.pdf; ComponentLink1Description: http://www.seielect.com/Catalog/SEI-RPC.pdf
R46 = ERJ-3GEY0R00V: RES 0.0 OHM 1/10W 0603 SMD; Manufacturer: Panasonic - ECG; Category 1: Resistors; Resistance (Ohms): 0.0; Power (Watts): 0.1W, 1/10W; Temperature Coefficient: -100/ +600ppm/°C; Tolerance: Jumper; OPI_VID: 101042; Supplier 1: Digi-Key; Supplier Part Number 1: P0.0GTR-ND; RoHS 1: RoHS Compliant; Description 1: RES 0.0 OHM 1/10W 0603 SMD; Stock 1: 25505000; Pricing 1: 5000=0.00171, 10000=0.00149, 25000=0.00131 (USD); Composition: Thick Film; Features: -; Size / Dimension: 0.063" L x 0.031" W (1.60mm x 0.80mm); Height: 0.018" (0.45mm); Lead Style: Surface Mount (SMD - SMT); Packaging: Tape & Reel (TR); Package / Case: 0603 (1608 Metric); ComponentLink1URL: http://industrial.panasonic.com/www-cgi/jvcr13pz.cgi?E+PZ+3+AOA0001+ERJ3GEY0R00V+7+WW; ComponentLink1Description: http://industrial.panasonic.com/www-cgi/jvcr13pz.cgi?E+PZ+3+AOA0001+ERJ3GEY0R00V+7+WW; Manufacturer Part Number: ERJ-3GEY0R00V
R54 = ERJ-3EKF2001V: RES 2K OHM 1/10W 1% 0603 SMD; Manufacturer: Panasonic Electronic Components; Power (Watts): 0.1W, 1/10W; Temperature Coefficient: ±100ppm/°C; OPI_VID: 101487; Supplier 1: Digi-Key; Supplier Part Number 1: P2.00KHTR-ND; Manufacturer Part Number: ERJ-3EKF2001V; RoHS: RoHS Compliant; Category: Resistors; Stock 1: 1000000; Pricing 1: 5000=0.00272, 10000=0.00236, 25000=0.00207, 50000=0.0019, 125000=0.00186 (CAD); Packaging: Tape & Reel (TR); Resistance (Ohms): 2k; Composition: Thick Film; Features: -; Tolerance: ±1%; Package / Case: 0603 (1608 Metric); Supplier Device Package: 0603; Size / Dimension: 0.063" L x 0.031" W (1.60mm x 0.80mm); Height: 0.022" (0.55mm); Number of Terminations: 2; ComponentLink1URL: http://industrial.panasonic.com/www-cgi/jvcr13pz.cgi?E+PZ+3+AOA0002+ERJ3EKF2001V+7+WW; ComponentLink1Description: http://industrial.panasonic.com/www-cgi/jvcr13pz.cgi?E+PZ+3+AOA0002+ERJ3EKF2001V+7+WW
R55-R57 R68 = ERJ-3GEYJ472V: RES 4.7K OHM 1/10W 5% 0603 SMD; Manufacturer: Panasonic - ECG; Power (Watts): 0.1W, 1/10W; Temperature Coefficient: ±200ppm/°C; OPI_VID: 101175; Supplier 1: Digi-Key; Supplier Part Number 1: P4.7KGTR-ND; Manufacturer Part Number: ERJ-3GEYJ472V; RoHS: RoHS Compliant; Category: Resistors; Stock 1: 6230000; Pricing 1: 5000=0.00174, 10000=0.00151, 25000=0.00132 (CAD); Resistance (Ohms): 4.7K; Composition: Thick Film; Features: -; Tolerance: ±5%; Package / Case: 0603 (1608 Metric); Size / Dimension: 0.063" L x 0.031" W (1.60mm x 0.80mm); Height: 0.022" (0.55mm); Number of Terminations: 2; Packaging: Tape & Reel (TR); ComponentLink1URL: http://industrial.panasonic.com/www-cgi/jvcr13pz.cgi?E+PZ+3+AOA0001+ERJ3GEYJ472V+7+WW; ComponentLink1Description: http://industrial.panasonic.com/www-cgi/jvcr13pz.cgi?E+PZ+3+AOA0001+ERJ3GEYJ472V+7+WW
R58 = ERJ-3GEYJ204V: RES 200K OHM 1/10W 5% 0603 SMD; Manufacturer: Panasonic Electronic Components; Resistance (Ohms): 100k; Power (Watts): 0.1W, 1/10W; Temperature Coefficient: ±200ppm/°C; OPI_VID: 101538; Supplier 1: Digi-Key; Supplier Part Number 1: P100KGTR-ND; Manufacturer Part Number: ERJ-3GEYJ204V; RoHS: RoHS Compliant; Category: Resistors; Stock 1: 3755000; Pricing 1: 5000=0.00172, 10000=0.00149, 25000=0.00131, 50000=0.0012, 125000=0.00118 (CAD); Composition: Thick Film; Features: -; Tolerance: ±5%; Package / Case: 0603 (1608 Metric); Size / Dimension: 0.063" L x 0.031" W (1.60mm x 0.80mm); Height: 0.022" (0.55mm); Number of Terminations: 2; Packaging: Tape & Reel (TR); ComponentLink1URL: http://industrial.panasonic.com/www-cgi/jvcr13pz.cgi?E+PZ+3+AOA0001+ERJ3GEYJ104V+7+WW; ComponentLink1Description: http://industrial.panasonic.com/www-cgi/jvcr13pz.cgi?E+PZ+3+AOA0001+ERJ3GEYJ104V+7+WW
R64 = RC1608F3654CS: RES 3M65 OHM 1/10W 1% 0603 SMD; Manufacturer: Samsung; Power (Watts): 0.1W, 1/10W; Temperature Coefficient: ±100ppm/°C; OPI_VID: 101535; Supplier 1: Digi-Key; Manufacturer Part Number: RC1608F3654CS; RoHS: RoHS Compliant; Category: Resistors; Stock 1: 210000; Pricing 1: 5000=0.00257, 10000=0.00224, 25000=0.00196, 50000=0.0018, 125000=0.00177 (CAD); Resistance (Ohms): 3M65; Composition: Thick Film; Features: -; Tolerance: ±1%; Package / Case: 0603 (1608 Metric); Size / Dimension: 0.063" L x 0.031" W (1.60mm x 0.80mm); Height: 0.022" (0.55mm); Number of Terminations: 2; Packaging: Tape & Reel (TR); ComponentLink1URL: http://digikey.com/Suppliers/ca/samsung-electro-mechanics.page?lang=en; Supplier Part Number: 1276-4964-2-ND; Supplier 2: Newark; Supplier Part Number 2: 94W5795